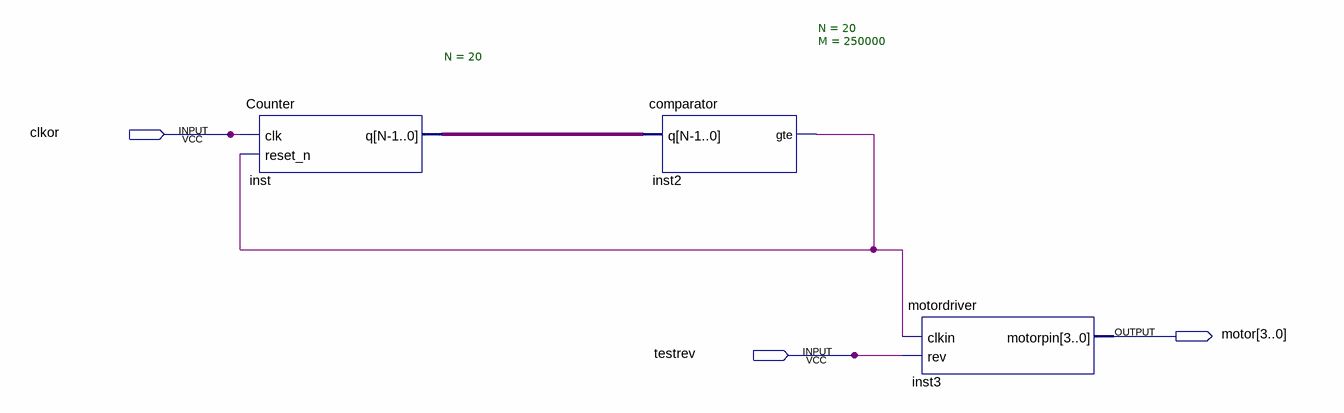
[diagram p0: schematic sheet]
// Quartus schematic InvertedPend.bdf as structural Verilog: 3 symbols, 3 pins
module InvertedPend (
  input  clkor,
  input  testrev,
  output [3:0] motor
);

  wire inst2_gte;
  wire [19:0] inst_q;

  Counter #(.N(20)) inst (.clk(clkor), .reset_n(inst2_gte), .q(inst_q));
  comparator #(.N(20), .M(250000)) inst2 (.q(inst_q), .gte(inst2_gte));
  motordriver inst3 (.clkin(inst2_gte), .rev(testrev), .motorpin(motor));
endmodule
